# EAGLE design edubrm-shield-3 (EAGLE 5.11)
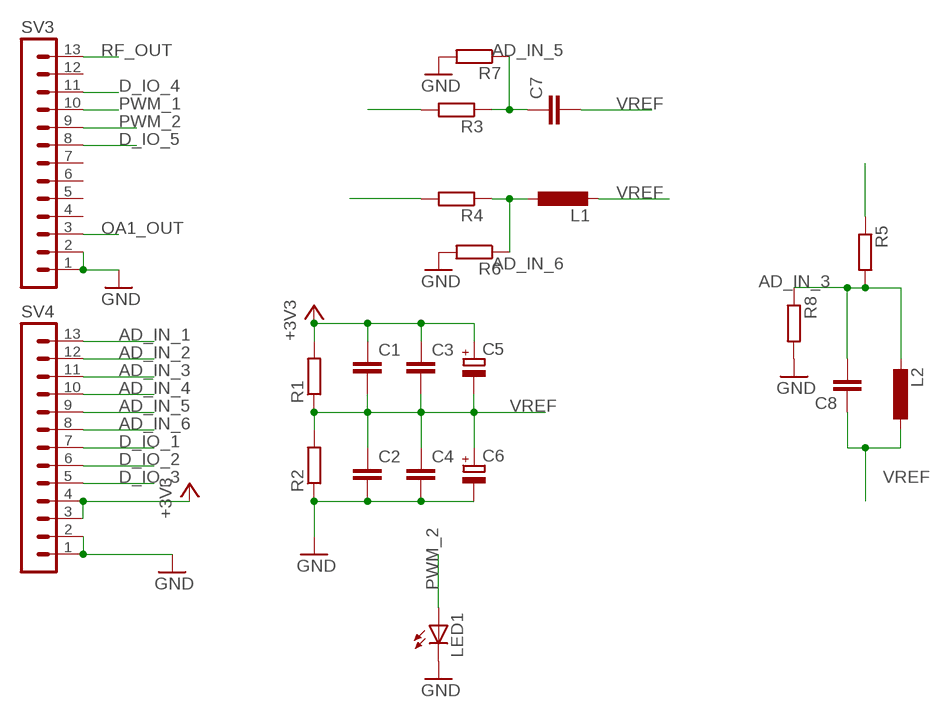
[diagram p0: schematic, sheet 1]

## Parts
C1  C-EUC1206  [C1206]
C2  C-EUC1206  [C1206]
C3  C-EUC1206  [C1206]
C4  C-EUC1206  [C1206]
C5  CPOL-EUSMCB  [SMC_B]
C6  CPOL-EUSMCB  [SMC_B]
C7  C-EU050-024X044  [C050-024X044]
C8  C-EU050-024X044  [C050-024X044]
L1  L-EU0207/10  [0207/10]
L2  L-EU0207/10  [0207/10]
LED1  LED3MM  [LED3MM]
R1  R-EU_M1206  [M1206]
R2  R-EU_M1206  [M1206]
R3  R-EU_M1206  [M1206]
R4  R-EU_M1206  [M1206]
R5  R-EU_M1206  [M1206]
R6  R-EU_M1206  [M1206]
R7  R-EU_M1206  [M1206]
R8  R-EU_M1206  [M1206]
SV3  MA13-1  [MA13-1]
SV4  MA13-1  [MA13-1]

## Nets
AD_IN_1: SV4.13
AD_IN_2: SV4.12
AD_IN_3: C8.2 L2.2 R5.2 R8.1 SV4.11
AD_IN_4: SV4.10
AD_IN_5: C7.1 R3.1 R7.1 SV4.9
AD_IN_6: L1.1 R4.1 R6.1 SV4.8
D_IO_1: R4.2 SV4.7
D_IO_2: R3.2 SV4.6
D_IO_3: R5.1 SV4.5
D_IO_4: SV3.11
D_IO_5: SV3.8
GND: C2.2 C4.2 C6.- LED1.K(C) R2.1 R6.2 R7.2 R8.2 SV3.1 SV3.2 SV4.1 SV4.2
OA1_OUT: SV3.3
PWM_1: SV3.10
PWM_2: LED1.A SV3.9
RF_OUT: SV3.13
VCC: C1.1 C3.1 C5.+ R1.2 SV4.3 SV4.4 ; supply symbol labelled +3V3
VREF: C1.2 C2.1 C3.2 C4.1 C5.- C6.+ C7.2 C8.1 L1.2 L2.1 R1.1 R2.2
Unconnected: SV3.4 SV3.5 SV3.6 SV3.7 SV3.12

## Library data of the parts
C1-C4 C7 C8 = rcl:C-EU: CAPACITOR, European symbol
C5 C6 = rcl:CPOL-EU: POLARIZED CAPACITOR, European symbol
L1 L2 = rcl:L-EU: INDUCTOR, European symbol
LED1 = led:LED: LED OSRAM: - CHIPLED LG R971, LG N971, LY N971, LG Q971, LY Q971, LO R971, LY R971 LH N974, LH R974 LS Q976, LO Q976, LY Q976 LO Q996 - Hyper CHIPLED LW Q18S LB Q993, LB Q99A, LB R99A - SideLED LS A670, LO A670, LY A670, LG A670, LP A670 LB A673, LV A673, LT A673, LW A673 LH A674 LY A675 LS A676, LA A676, LO A676, LY A676, LW A676 LS A679, LY A679, LG A679 - Hyper Micro SIDELED® LS Y876, LA Y876, LO Y876, LY Y876 LT Y87S - SmartLED LW L88C, LW L88S LB L89C, LB L89S, LG L890 LS L89K, LO L89K, LY L89K LS L896, LA L896, LO L896, LY L896 - TOPLED LS T670, LO T670, LY T670, LG T670, LP T670 LSG T670, LSP T670, LSY T670, LOP T670, LYG T670 LG T671, LOG T671, LSG T671 LB T673, LV T673, LT T673, LW T673 LH T674 LS T676, LA T676, LO T676, LY T676, LB T676, LH T676, LSB T676, LW T676 LB T67C, LV T67C, LT T67C, LS T67K, LO T67K, LY T67K, LW E67C LS E67B, LA E67B, LO E67B, LY E67B, LB E67C, LV E67C, LT E67C LW T67C LS T679, LY T679, LG T679 LS T770, LO T770, LY T770, LG T770, LP T770 LB T773, LV T773, LT T773, LW T773 LH T774 LS E675, LA E675, LY E675, LS T675 LS T776, LA T776, LO T776, LY T776, LB T776 LHGB T686 LT T68C, LB T68C - Hyper Mini TOPLED® LB M676 - Mini TOPLED Santana® LG M470 LS M47K, LO M47K, LY M47K Source: http://www.osram.convergy.de LUXEON: - LUMILED® LXK2-PW12-R00, LXK2-PW12-S00, LXK2-PW14-U00, LXK2-PW14-V00 LXK2-PM12-R00, LXK2-PM12-S00, LXK2-PM14-U00 LXK2-PE12-Q00, LXK2-PE12-R00, LXK2-PE12-S00, LXK2-PE14-T00, LXK2-PE14-U00 LXK2-PB12-K00, LXK2-PB12-L00, LXK2-PB12-M00, LXK2-PB14-N00, LXK2-PB14-P00, LXK2-PB14-Q00 LXK2-PR12-L00, LXK2-PR12-M00, LXK2-PR14-Q00, LXK2-PR14-R00 LXK2-PD12-Q00, LXK2-PD12-R00, LXK2-PD12-S00 LXK2-PH12-R00, LXK2-PH12-S00 LXK2-PL12-P00, LXK2-PL12-Q00, LXK2-PL12-R00 Source: www.luxeon.com KINGBRIGHT: KA-3528ASYC Source: www.kingbright.com
R1-R8 = rcl:R-EU_: RESISTOR, European symbol
SV3 SV4 = con-lstb:MA13-1: PIN HEADER; OC_FARNELL: unknown; OC_NEWARK: unknown

## Board
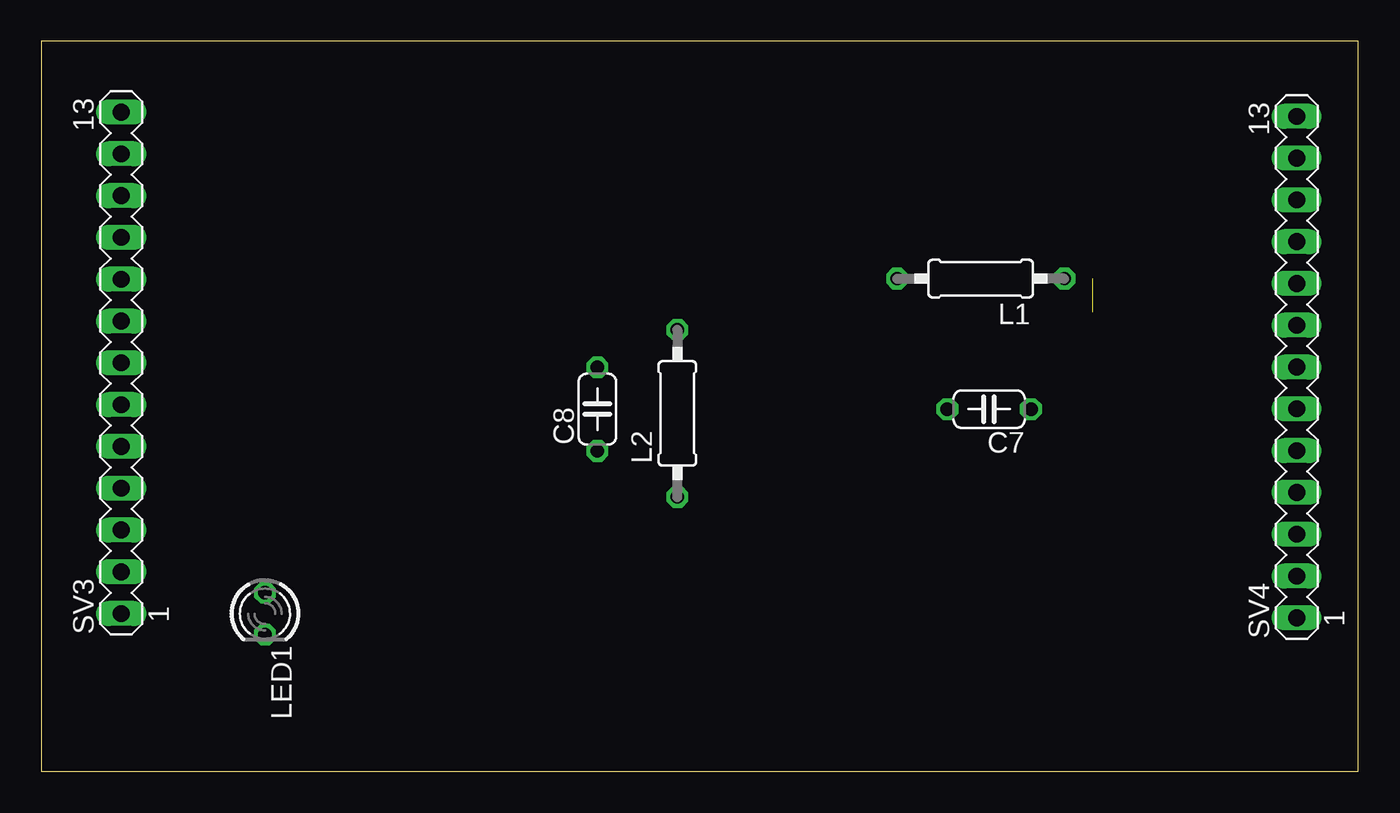
[diagram p1: board, top side]
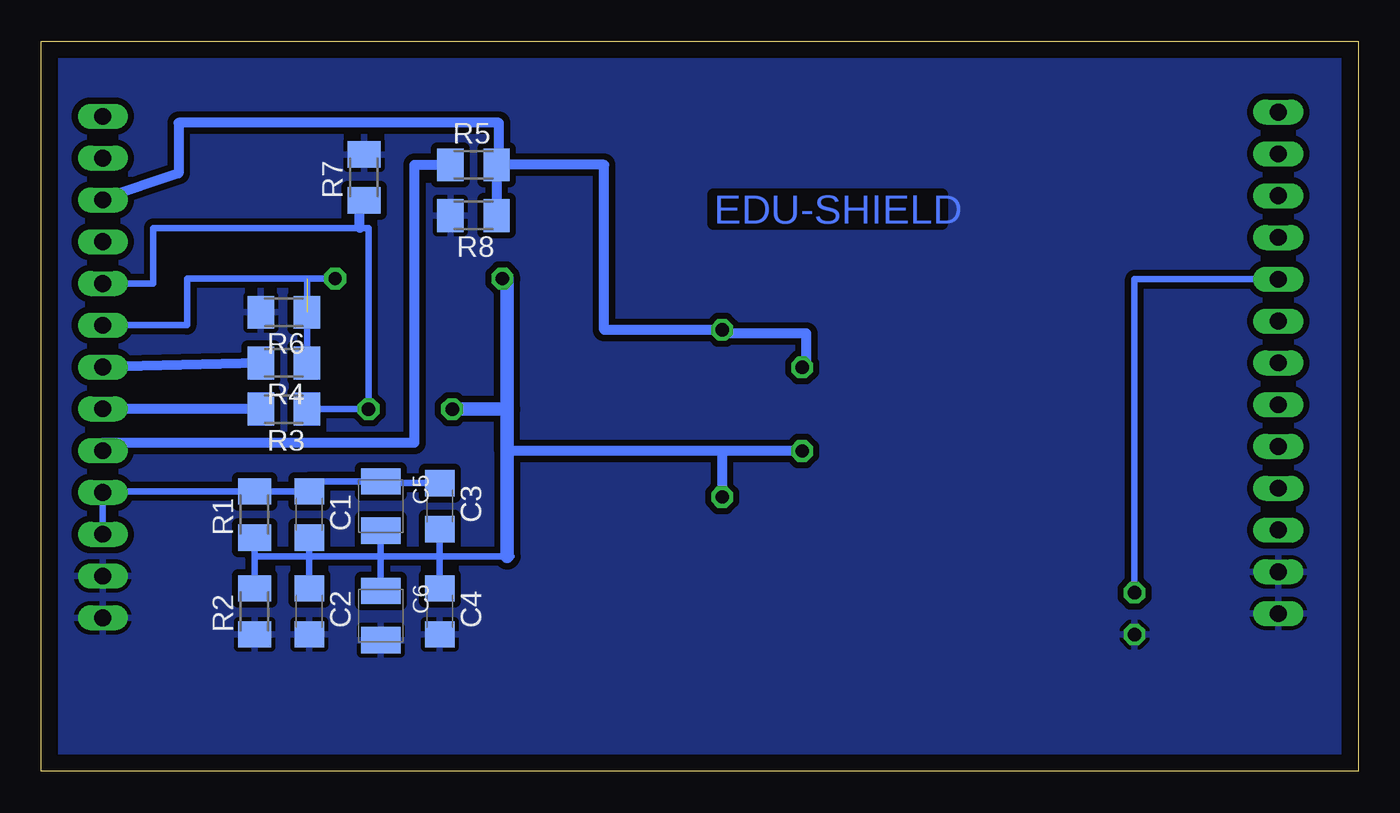
[diagram p2: board, bottom side, seen from below]

Size 80.03 x 44.38 mm. Coordinates in mm from the lower left corner, seen from the top.
Outline: 0,0 80.03,0 80.03,44.38 0,44.38 0,0
Copper layers (1*16): Top 0.035mm / dielectric 1.5mm / Bottom 0.035mm
Design rules "default *": minimum track width 10mil, minimum drill 24mil, track to track 15mil, track to pad 12mil, pad to pad 8mil, via to via 8mil, smd to smd 8mil, copper to edge 40mil, drill to drill 8mil, minimum pad ring 10mil, minimum via ring 8mil, stop-mask expansion 4mil, vias tented up to drill 0mil, thermal gap 10mil

### Footprints (pad centres in the part's own frame; a part is rotated, then mirrored left to right if it is on the bottom)
C1206 = smd 1.6 x 1.8: 1 -1.4,0; 2 1.4,0
SMC_B = smd 1.6 x 2.4: + -1.5,0; - 1.5,0
C050-024X044 = drill 0.813 octagon: 1 -2.54,0; 2 2.54,0
0207/10 = drill 0.813 octagon: 1 -5.08,0; 2 5.08,0
LED3MM = drill 0.813 octagon: A -1.27,0; K 1.27,0
M1206 = smd 1.6 x 2: 1 -1.4,0; 2 1.4,0
MA13-1 = drill 1.016 long: 1 -15.24,0; 2 -12.7,0; 3 -10.16,0; 4 -7.62,0; 5 -5.08,0; 6 -2.54,0; 7 0,0; 8 2.54,0; 9 5.08,0; 10 7.62,0; 11 10.16,0; 12 12.7,0; 13 15.24,0

### Placement (x,y rotation side)
C1  63.74,15.62 270 bottom
C2  63.74,9.73 270 bottom
C3  55.81,16.13 270 bottom
C4  55.81,9.73 270 bottom
C5  59.39,16.13 270 bottom
C6  59.39,9.47 270 bottom
C7  57.6,22.02 180 top
C8  33.79,22.02 90 top
L1  57.09,29.95 180 top
L2  38.66,21.76 90 top
LED1  13.6,9.59 270 top
R1  67.07,15.62 90 bottom
R2  67.07,9.73 90 bottom
R3  65.28,22.02 180 bottom
R4  65.28,24.83 180 bottom
R5  53.76,36.86 0 bottom
R6  65.28,27.9 180 bottom
R7  60.42,36.1 90 bottom
R8  53.76,33.79 180 bottom
SV3  4.86,24.83 90 top
SV4  76.29,24.58 90 top

### Tracks (layer width: path | path; a pad name or v marks a point on that pad's centre or on a via)
AD_IN_3
  Bottom 0.61: C8.2 33.54,24.56 33.54,26.62 38.66,26.62 L2.2 45.82,26.84 45.82,36.86 R5.2 | R5.2 52.22,36.86 52.22,39.42 71.68,39.42 71.68,36.35 76.29,34.82 SV4.11 | R5.2 R8.1
AD_IN_5
  Bottom 0.406: SV4.9 73.22,29.66 73.22,33.02 60.67,33.02 60.14,33.02 C7.1 R3.1
  Bottom 0.61: R7.1 60.67,34.7 60.67,33.02
AD_IN_6  (1 unrouted)
  Bottom 0.406: 63.88,29.95 L1.1 | R4.1 63.88,29.95 | SV4.8 71.17,27.12 71.17,29.95 63.88,29.95
D_IO_1
  Bottom 0.61: R4.2 SV4.7
D_IO_2
  Bottom 0.61: R3.2 76.29,22.02 SV4.6
D_IO_3
  Bottom 0.61: R5.1 57.34,36.86 57.34,19.97 76.29,19.97 SV4.5
GND
  pour Bottom: -1.54,45.57 81.66,45.57 81.66,-1.79 -1.54,-1.79
PWM_2
  Bottom 0.406: SV3.9 13.6,29.91 LED1.A
VCC
  Bottom 0.406: C3.1 59.39,17.53 C5.+ 63.74,17.63 C1.1 R1.2 76.29,17.02 SV4.4 SV4.3
VREF
  Bottom 0.406: 55.81,13.06 C4.1 | 55.81,13.06 59.39,13.06 | 59.39,13.06 63.74,13.06 | 63.74,13.06 67.07,13.06 | 67.07,13.06 R1.1 | 63.74,13.06 C2.1 | 63.74,13.06 C1.2 | 59.39,13.06 C5.- | 59.39,13.06 C6.+ | 55.81,13.06 C3.2 | 67.07,13.06 R2.2 | 51.46,13.06 51.71,13.06 55.81,13.06
  Bottom 0.61: L2.1 38.66,19.48 C8.1 51.71,19.48 51.71,19.46
  Bottom 0.813: 51.71,22.02 C7.2 | 51.71,13.06 51.71,19.46 51.71,22.02 | L1.2 51.71,29.95 51.71,22.02

### Text on the board
Bottom: EDU-SHIELD